# Altium schematic sheet XH-DSP.schdoc
size 309 x 223 mm; Symbol: Sheet-Symbol_A4; Device: Sheet-Symbol_A4; Company: 嘉立创EDA; Version: V1.0; Page Size: A4; @Project Name: XH-DSP; @Page Count: 1; @Update Date: 2024-03-15; @Create Date: 2024-03-03; @Schematic Name: Schematic1; @Page No: 1; @Page Name: P1
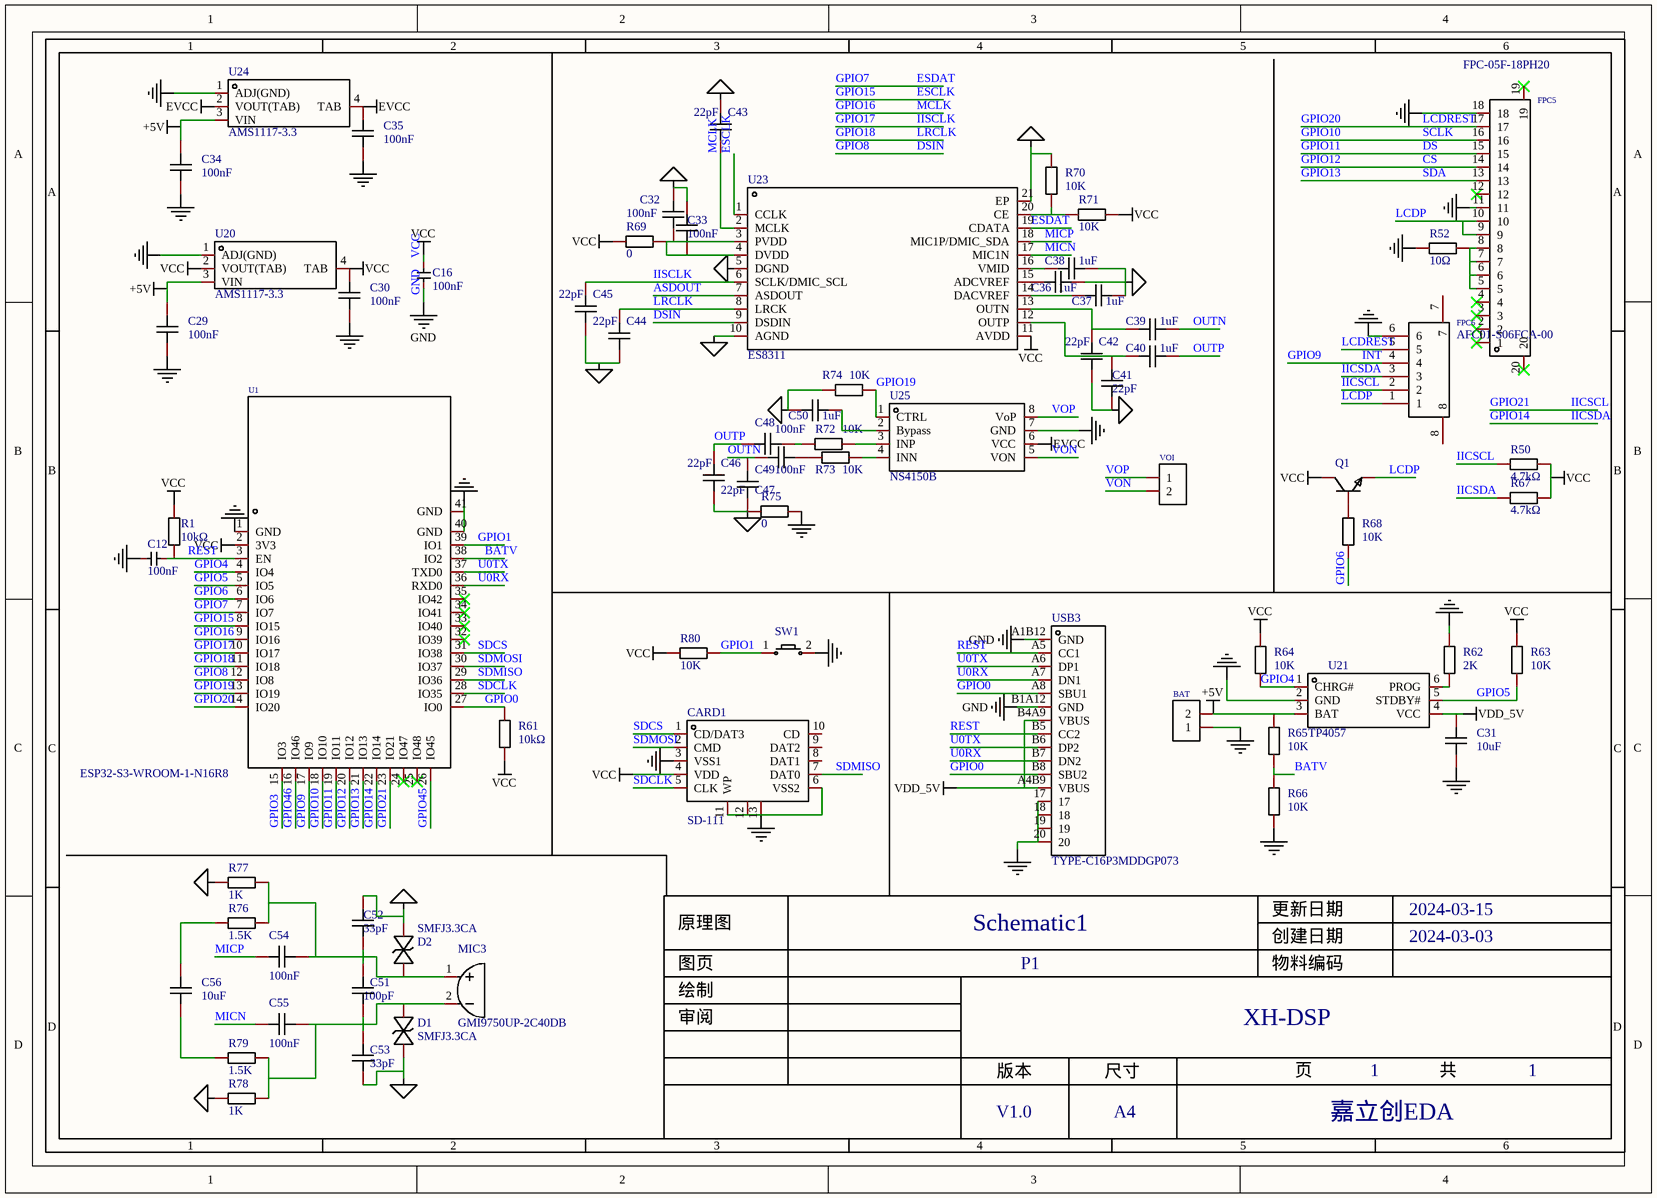
[diagram p0: XH-DSP.schdoc]

## Parts
BAT  HDR-F_2.54_1x2P  [HDR-TH_2P-P2.54-V-F]  (value not drawn)
C12  100nF  [C0402]
C16  100nF  [C0402]
C29  100nF  [C0805]
C30  100nF  [C0805]
C31  10uF  [C0603]
C32  100nF  [C0402]
C33  100nF  [C0402]
C34  100nF  [C0805]
C35  100nF  [C0805]
C36  1uF  [C0402]
C37  1uF  [C0402]
C38  1uF  [C0402]
C39  1uF  [C0402]
C40  1uF  [C0402]
C41  22pF  [C0402]
C42  22pF  [C0402]
C43  22pF  [C0402]
C44  22pF  [C0402]
C45  22pF  [C0402]
C46  22pF  [C0402]
C47  22pF  [C0402]
C48  100nF  [C0402]
C49  100nF  [C0402]
C50  1uF  [C0402]
C51  100pF  [C0402]
C52  33pF  [C0402]
C53  33pF  [C0402]
C54  100nF  [C0402]
C55  100nF  [C0402]
C56  10uF  [C0603]
CARD1  SD-111  [SD-SMD_SD-01A]
D1  SMFJ3.3CA  [SOD-123_L2.7-W1.6-LS3.7-BI]
D2  SMFJ3.3CA  [SOD-123_L2.7-W1.6-LS3.7-BI]
FPC5  FPC-05F-18PH20  [FPC-SMD_18P-P0.50_FPC-05F-18PH20]
FPC6  AFC01-S06FCA-00  [FPC-SMD_P0.50-6P_AFC01-S06FCA-00]
MIC3  GMI9750UP-2C40DB  [MIC-TH_BD9.7-P2.50-D0.8-L-FD]
Q1  S8050_SOT_NPN  [S8050_SOT-23]  (value not drawn)
R1  10kΩ  [R0603]
R50  4.7kΩ  [R0402]
R52  10Ω  [R0402]
R61  10kΩ  [R0603]
R62  2K  [R0402]
R63  10K  [R0603]
R64  10K  [R0603]
R65  10K  [R0603]
R66  10K  [R0603]
R67  4.7kΩ  [R0402]
R68  10K  [R0603]
R69  0  [R0402]
R70  10K  [R0402]
R71  10K  [R0402]
R72  10K  [R0402]
R73  10K  [R0402]
R74  10K  [R0402]
R75  0  [R0402]
R76  1.5K  [R0402]
R77  1K  [R0402]
R78  1K  [R0402]
R79  1.5K  [R0402]
R80  10K  [R0402]
SW1  Key_SMD_3x4x2  [Key_SMD_3x4x2]  (value not drawn)
U1  ESP32-S3-WROOM-1-N16R8  [WIRELM-SMD_ESP32-S3-WROOM-1]
U20  AMS1117-3.3  [SOT-223-4_L6.5-W3.5-P2.30-LS7.0-BR]
U21  TP4057  [SOT-23-6_L2.9-W1.6-P0.95-LS2.8-BR]
U23  ES8311  [WQFN-20_L3.0-W3.0-P0.40-BL-EP1.7]
U24  AMS1117-3.3  [SOT-223-4_L6.5-W3.5-P2.30-LS7.0-BR]
U25  NS4150B  [MSOP-8_L3.0-W3.0-P0.65-LS5.0-BL]
USB3  TYPE-C16P3MDDGP073  [USB-SMD_TYPE-C16PIN-1]
VOI  HDR-F_2.54_1x2P  [HDR-TH_2P-P2.54-V-F]  (value not drawn)

## Nets
+5V: BAT.2 C29.2 C34.2 R65.2 U20.3(VIN) U21.3(BAT) U24.3(VIN)
EVCC: C35.2 U24.2(VOUT(TAB)) U24.4(TAB) U25.6(VCC)
GND: C16.1 USB3.17 USB3.18 USB3.19 USB3.20 USB3.A1B12(GND) USB3.B1A12(GND)
NetBAT_1: BAT.1 C12.2 C29.1 C30.1 C31.1 C32.2 C33.2 C34.1 C35.1 C36.2 C37.2 C38.2 C41.1 C42.1 C43.2 C44.1 C45.1 C46.1 C47.1 C50.1 C52.2 C53.1 CARD1.3(VSS1) CARD1.6(VSS2) CARD1.11(WP) CARD1.12(EP) CARD1.13(EP) D1.1 D2.2 FPC5.11 FPC5.18 FPC6.6 R52.2 R62.2 R66.2 R70.2 R74.1 R75.1 R75.2 R77.2 R78.2 SW1.2 U1.1(GND) U1.40(GND) U1.41(GND) U20.1(ADJ(GND)) U21.2(GND) U23.5(DGND) U23.10(AGND) U23.21(EP) U24.1(ADJ(GND)) U25.7(GND)
VCC: C16.2 C30.2 CARD1.4(VDD) Q1.3 R1.2 R50.2 R61.1 R63.2 R64.2 R67.2 R69.1 R71.1 R80.1 U1.2(3V3) U20.2(VOUT(TAB)) U20.4(TAB) U23.11(AVDD)
VDD_5V: C31.2 U21.4(VCC) USB3.A4B9(VBUS) USB3.B4A9(VBUS)
ASDOUT: U23.7(ASDOUT)
BATV: R65.1 R66.1 U1.38(IO2)
CS: FPC5.14 U1.20(IO12)  [also labelled GPIO12]
DS: FPC5.15 U1.19(IO11)  [also labelled GPIO11]
DSIN: U1.12(IO8) U23.9(DSDIN)  [also labelled GPIO8]
ESCLK: U1.8(IO15) U23.1(CCLK)  [also labelled GPIO15]
ESDAT: U1.7(IO7) U23.19(CDATA)  [also labelled GPIO7]
GPIO0: R61.2 U1.27(IO0) USB3.A8(SBU1) USB3.B8(SBU2)
GPIO1: R80.2 SW1.1 U1.39(IO1)
GPIO3: U1.15(IO3)
GPIO4: R64.1 U1.4(IO4) U21.1(CHRG#)
GPIO5: R63.1 U1.5(IO5) U21.5(STDBY#)
GPIO6: R68.1 U1.6(IO6)
GPIO9: FPC6.4 U1.17(IO9)  [also labelled INT]
GPIO10: FPC5.16 U1.18(IO10)  [also labelled SCLK]
GPIO13: FPC5.13 U1.21(IO13)  [also labelled SDA]
GPIO14: FPC6.3 R67.1 U1.22(IO14)  [also labelled IICSDA]
GPIO16: C43.1 U1.9(IO16) U23.2(MCLK)  [also labelled MCLK]
GPIO17: C45.2 U1.10(IO17) U23.6(SCLK/DMIC_SCL)  [also labelled IISCLK]
GPIO18: C44.2 U1.11(IO18) U23.8(LRCK)  [also labelled LRCLK]
GPIO19: R74.2 U1.13(IO19) U25.1(CTRL)
GPIO20: FPC5.17 FPC6.5 U1.14(IO20)  [also labelled LCDREST]
GPIO21: FPC6.2 R50.1 U1.23(IO21)  [also labelled IICSCL]
GPIO45: U1.26(IO45)
GPIO46: U1.16(IO46)
LCDP: FPC5.9 FPC5.10 FPC6.1 Q1.2
MICN: C55.1 U23.17(MIC1N)
MICP: C54.1 U23.18(MIC1P/DMIC_SDA)
OUTN: C39.2 C47.2 C49.1
OUTP: C40.2 C46.2 C48.1
REST: C12.1 R1.1 U1.3(EN) USB3.A5(CC1) USB3.B5(CC2)
SDCLK: CARD1.5(CLK) U1.28(IO35)
SDCS: CARD1.1(CD/DAT3) U1.31(IO38)
SDMISO: CARD1.7(DAT0) U1.29(IO36)
SDMOSI: CARD1.2(CMD) U1.30(IO37)
U0RX: U1.36(RXD0) USB3.A7(DN1) USB3.B7(DN2)
U0TX: U1.37(TXD0) USB3.A6(DP1) USB3.B6(DP2)
VON: U25.5(VON) VOI.2
VOP: U25.8(VoP) VOI.1
NetC32_1: C32.1 C33.1 R69.2 U23.3(PVDD) U23.4(DVDD)
NetC36_1: C36.1 U23.15(ADCVREF)
NetC37_1: C37.1 U23.14(DACVREF)
NetC38_1: C38.1 U23.16(VMID)
NetC39_1: C39.1 C42.2 U23.13(OUTN)
NetC40_1: C40.1 C41.2 U23.12(OUTP)
NetC48_2: C48.2 R72.1
NetC49_2: C49.2 R73.1
NetC50_2: C50.2 U25.2(Bypass)
NetC51_1: C51.1 C53.2 C55.2 D1.2 MIC3.2 R78.1 R79.1
NetC51_2: C51.2 C52.1 C54.2 D2.1 MIC3.1 R76.1 R77.1
NetC56_1: C56.1 R79.2
NetC56_2: C56.2 R76.2
NetFPC5_5: FPC5.5 FPC5.6 FPC5.7 FPC5.8 R52.1
NetQ1_1: Q1.1 R68.2
NetR62_1: R62.1 U21.6(PROG)
NetR70_1: R70.1 R71.2 U23.20(CE)
NetR72_2: R72.2 U25.3(INP)
NetR73_2: R73.2 U25.4(INN)

Not connected (* = marked no-connect by the designer): CARD1 8(DAT1) 9(DAT2) 10(CD); FPC5 1* 2* 3* 4* 12* 19* 20*; FPC6 7 8; U1 24(IO47)* 25(IO48)* 32(IO39)* 33(IO40)* 34(IO41)* 35(IO42)*

## Notes on the sheet
- 1
- 2
- 3
- 4
- 5
- 6
- A
- B
- C
- 原理图
- Schematic1
- 创建日期
- 更新日期
- 2024-03-15
- 2024-03-03
- 审阅
- 绘制
- 图页
- P1
- 物料编码
- XH-DSP
- D
- 版本
- 尺寸
- 页
- 共
- V1.0
- A4
- 嘉立创EDA

## Library data of the parts
BAT VOI = HDR-F_2.54_1x2P: Manufacturer: BOOMELE(博穆精密); Manufacturer Part: 2.54-1*2P母; Symbol: Header-Female-2.54_1x2; Convert to PCB: yes; Device: HDR-F_2.54_1x2P; Supplier: LCSC; Supplier Part: C49661; JLCPCB Part Class: Extended Part; Add into BOM: yes; Supplier Footprint: 插件
C12 C16 = CL05B104KO5NNNC: 容值:100nF;精度:±10%;额定电压:16V;材质(温度系数):X7R;; Manufacturer: SAMSUNG(三星); Symbol: 电容-0402; Add into BOM: yes; Tolerance: ±10%; Voltage Rated: 16V; Temperature Coefficient: X7R; Origin Footprint: C-0402; Name: 100nF; Device: CL05B104KO5NNNC; LCSC Part Name: 100nF ±10% 16V; Supplier Part: C1525; Manufacturer Part: CL05B104KO5NNNC; Supplier Footprint: 0402; JLCPCB Part Class: Basic Part; Datasheet: https://atta.szlcsc.com/upload/public/pdf/source/20160103/1457707674891.pdf; Supplier: LCSC; Convert to PCB: yes; Value: 100nF; Design Item ID: 电容-0402; Library Name: MyPcbLib
C29 C30 C34 C35 = 0805B104K500NT: Manufacturer: FH(风华); Symbol: CapAcitance; Add into BOM: yes; Tolerance: ±10%; Voltage Rated: 50V; Temperature Coefficient: X7R; Description: 容值:100nF;精度:±10%;额定电压:50V;材质(温度系数):X7R;; Name: 100nF; Device: 0805B104K500NT; LCSC Part Name: 100nF ±10% 50V; Supplier Part: C38141; Manufacturer Part: 0805B104K500NT; Supplier Footprint: 0805; JLCPCB Part Class: Extended Part; Datasheet: https://atta.szlcsc.com/upload/public/pdf/source/20170923/C38141_1506149447419988747.pdf; Supplier: LCSC; Convert to PCB: yes; Value: 100nF
C31 = CAP_0603: Symbol: CapAcitance; Convert to PCB: yes; Name: 10uF; Device: CAP_0603; Add into BOM: yes; Supplier Footprint: 0603; Value: 10uF
C32 C33 C36-C56 = CAP_0402: Symbol: CapAcitance; Convert to PCB: yes; Device: CAP_0402; Add into BOM: yes; Supplier Footprint: 0402
  C32 C33 C48 C49 C54 C55: Name: 100nF; Value: 100nF
  C36-C40 C50: Name: 1uF; Value: 1uF
  C41-C47: Name: 22pF; Value: 22pF
  C51: Name: 100pF; Value: 100pF
  C52 C53: Name: 33pF; Value: 33pF
  C56: Name: 10uF; Value: 10uF
CARD1 = SD-111: Manufacturer: HANBO(汉博); Add into BOM: yes; Card Connection Mode: 自弹式; Card Type: 标准SD卡; Connector Type: 卡座; Maximum Body Height: 2.9mm; Description: 卡连接方式:自弹式;卡类型:标准SD卡;连接器类型:卡座;本体最大高度:2.9mm;触头镀层:镀金;工作温度范围:-45℃~+85℃;; Name: SD-111; Symbol: SD-111; Device: SD-111; Supplier: LCSC; Supplier Part: C410353; Manufacturer Part: SD-111; JLCPCB Part Class: 扩展库; LCSC Part Name: 自弹式 标准SD卡 卡座; Supplier Footprint: SMD; Datasheet: https://atta.szlcsc.com/upload/public/pdf/source/20221111/A999E082C083ECA57C7E4E96336E71F5.pdf; Convert to PCB: yes; Contact Plating: 镀金; Operating Temperature Range: -45℃~+85℃
D1 D2 = SMFJ3.3CA: Manufacturer: BORN(伯恩半导体); Add into BOM: yes; Type: ESD; Description: SOD-123 200W  VRWM=3.3V 双向 功率TVS 电源口等; Name: SMFJ3.3CA; Symbol: SMFJ3.3CA; Device: SMFJ3.3CA; Supplier: LCSC; Supplier Part: C511919; Manufacturer Part: SMFJ3.3CA; JLCPCB Part Class: 扩展库; LCSC Part Name: SMFJ3.3CA; Supplier Footprint: SOD-123; Datasheet: https://atta.szlcsc.com/upload/public/pdf/source/20220819/7A7ECAA22EB2D2C0D7168D96D0DEA0BB.pdf; Convert to PCB: yes
FPC5 = FPC-05F-18PH20: Manufacturer: XUNPU(讯普); Add into BOM: yes; Pitch: 0.5mm; Number of Contacts: 18P; Locking Feature: 翻盖式; FFC, FCB Thickness: 0.3mm; Description: 间距:0.5mm;触点数量:18P;锁定特性:翻盖式;安装类型:卧贴;触点类型:下接;工作温度范围:-25℃~+85℃;; Name: FPC-05F-18PH20; Symbol: FPC-05F-18PH20; Device: FPC-05F-18PH20; Supplier: LCSC; Supplier Part: C2856802; Manufacturer Part: FPC-05F-18PH20; JLCPCB Part Class: 扩展库; LCSC Part Name: 0.5mm P数:18P 翻盖式 下接; Supplier Footprint: SMD,P=0.5mm; Datasheet: https://atta.szlcsc.com/upload/public/pdf/source/20210922/C2856802_2A845D1961F33AEC1ED22CECB292335F.pdf; Convert to PCB: yes; Mounting Type: 卧贴; Contact Type: 下接; Height Above Board: 2mm; Operating Temperature Range: -25℃~+85℃
FPC6 = AFC01-S06FCA-00: Manufacturer: JS(钜硕电子); Add into BOM: yes; Pitch: 0.5mm; Number of Contacts: 6; Locking Feature: 翻盖式; FFC, FCB Thickness: 0.3mm~0.3mm; Description: 间距:0.5mm;触点数量:6;锁定特性:翻盖式;安装类型:卧贴;触点类型:下接;; Name: AFC01-S06FCA-00; Symbol: AFC01-S06FCA-00; Device: AFC01-S06FCA-00; Supplier: LCSC; Supplier Part: C262655; Manufacturer Part: AFC01-S06FCA-00; JLCPCB Part Class: 扩展库; LCSC Part Name: FPC 0.5MM 6P 翻盖式 H2.0mm 下接; Supplier Footprint: P=0.5mm; Convert to PCB: yes; Mounting Type: 卧贴; Contact Type: 下接; Height Above Board: 2mm
MIC3 = GMI9750UP-2C40DB: Manufacturer: INGHAi(赢海); Add into BOM: yes; Name: GMI9750UP-2C40DB; Symbol: GMI9750UP-2C40DB; Device: GMI9750UP-2C40DB; LCSC Part Name: GMI9750UP-2C40DB; Supplier Part: C530221; Manufacturer Part: GMI9750UP-2C40DB; Supplier Footprint: -; JLCPCB Part Class: 扩展库; Datasheet: https://atta.szlcsc.com/upload/public/pdf/source/20231017/7730F5E17633AEF7C001E490CA532738.pdf; Supplier: LCSC; Convert to PCB: yes
Q1 = S8050_SOT_NPN: Symbol: NPN; Convert to PCB: yes; Device: S8050_SOT_NPN; Add into BOM: yes; Supplier Footprint: SOT-23
R1 R61 = 0603WAF1002T5E: Manufacturer: UNI-ROYAL(厚声); Add into BOM: yes; Tolerance: ±1%; Power(Watts): 100mW; Temperature Coefficient: ±100ppm/℃; Overload Voltage (Max): 75V; Description: 电阻类型:厚膜电阻;阻值:10kΩ;精度:±1%;功率:100mW;; Name: 10kΩ; Symbol: 0603WAF1002T5E; Device: 0603WAF1002T5E; LCSC Part Name: 厚膜电阻 10kΩ ±1% 100mW; Supplier Part: C25804; Manufacturer Part: 0603WAF1002T5E; Supplier Footprint: 0603; JLCPCB Part Class: Basic Part; Datasheet: https://atta.szlcsc.com/upload/public/pdf/source/20200306/C422600_1E6D84923E4A46A82E41ADD87F860B5C.pdf; Supplier: LCSC; Convert to PCB: yes; Type: 厚膜电阻; Value: 10kΩ; Operating Temperature Range: -55℃~+155℃
R50 R67 = 0402WGF4701TCE: Manufacturer: UNI-ROYAL(厚声); Add into BOM: yes; Tolerance: ±1%; Power(Watts): 62.5mW; Temperature Coefficient: ±100ppm/℃; Overload Voltage (Max): 50V; Description: 电阻类型:厚膜电阻;阻值:4.7kΩ;精度:±1%;功率:62.5mW;; Name: 4.7kΩ; Symbol: 0402WGF4701TCE; Device: 0402WGF4701TCE; LCSC Part Name: 4.7kΩ ±1% 62.5mW; Supplier Part: C25900; Manufacturer Part: 0402WGF4701TCE; Supplier Footprint: 0402; JLCPCB Part Class: 基础库; Datasheet: https://atta.szlcsc.com/upload/public/pdf/source/20200306/C422600_1E6D84923E4A46A82E41ADD87F860B5C.pdf; Supplier: LCSC; Convert to PCB: yes; Type: 厚膜电阻; Value: 4.7kΩ; Operating Temperature Range: -55℃~+155℃
R52 = 0402WGF100JTCE: Manufacturer: UNI-ROYAL(厚声); Symbol: 0402WGF1001TCE; Add into BOM: yes; Tolerance: ±1%; Power(Watts): 62.5mW; Temperature Coefficient: ±200ppm/℃; Overload Voltage (Max): 50V; Description: 电阻类型:厚膜电阻;阻值:10Ω;精度:±1%;功率:62.5mW;; Name: 10Ω; Device: 0402WGF100JTCE; LCSC Part Name: 10Ω ±1% 62.5mW; Supplier Part: C25077; Manufacturer Part: 0402WGF100JTCE; Supplier Footprint: 0402; JLCPCB Part Class: Basic Part; Datasheet: https://atta.szlcsc.com/upload/public/pdf/source/20200306/C422600_1E6D84923E4A46A82E41ADD87F860B5C.pdf; Supplier: LCSC; Convert to PCB: yes; Type: 厚膜电阻; Value: 10Ω; Operating Temperature Range: -55℃~+155℃
R62 R69-R80 = Res_0402: Symbol: 电阻; Convert to PCB: yes; Device: Res_0402; Add into BOM: yes; Supplier Footprint: 0402
  R62: Name: 2K; Value: 2K
  R69 R75: Name: 0; Value: 0
  R70-R74 R80: Name: 10K; Value: 10K
  R76 R79: Name: 1.5K; Value: 1.5K
  R77 R78: Name: 1K; Value: 1K
R63-R66 R68 = Res_0603: Symbol: 电阻; Convert to PCB: yes; Name: 10K; Device: Res_0603; Add into BOM: yes; Supplier Footprint: 0603; Value: 10K
SW1 = Key_SMD_3x4x2: Symbol: 轻触按键x2; Convert to PCB: yes; Device: Key_SMD_3x4x2; Add into BOM: yes; Supplier Footprint: SMD
U1 = ESP32-S3-WROOM-1-N16R8: Manufacturer: ESPRESSIF(乐鑫); Symbol: ESP32-S3-WROOM-1(N16R8); Add into BOM: yes; Name: ESP32-S3-WROOM-1-N16R8; Device: ESP32-S3-WROOM-1-N16R8; Supplier: LCSC; Supplier Part: C2913202; Manufacturer Part: ESP32-S3-WROOM-1-N16R8; JLCPCB Part Class: 扩展库; LCSC Part Name: 通用型Wi-Fi+低功耗蓝牙MCU模组; Supplier Footprint: SMD,18x25.5mm; Datasheet: https://atta.szlcsc.com/upload/public/pdf/source/20220705/4E799F39581577F766659887F738A439.pdf; Convert to PCB: yes
U20 U24 = AMS1117-3.3_C347222: Manufacturer: UMW(广东友台半导体); Add into BOM: yes; Output Type: 固定; Output Polarity: 正; Number of Outputs: 1; Maximum Input Voltage: 18V; Output Voltage: 3.3V; Dropout Voltage: 1.3V@(1A); Output Current: 1A; Power Supply Rejection Ratio (PSRR): 60dB@(120Hz); Description: 输出类型:固定;输出极性:正;最大输入电压:18V;输出电压:3.3V;输出电流:1A;电源纹波抑制比(PSRR):60dB@(120Hz);; Name: AMS1117-3.3; Symbol: AMS1117-3.3_C347222; Device: AMS1117-3.3_C347222; LCSC Part Name: AMS1117-3.3; Supplier Part: C347222; Manufacturer Part: AMS1117-3.3; Supplier Footprint: SOT-223; JLCPCB Part Class: Extended Part; Datasheet: https://atta.szlcsc.com/upload/public/pdf/source/20211011/50CC665C22E3A66C08379A4A74BDA25C.pdf; Supplier: LCSC; Convert to PCB: yes
U21 = TP4057: Manufacturer: UMW(友台半导体); Symbol: TP4057_C725791; Add into BOM: yes; Supply Voltage: 6.5V; Maximum Charge Current: 500mA; Type of Battery: 锂离子/聚合物; Number of Cells: 1; Description: 电源电压:6.5V;最大充电电流:500mA;电池类型:锂离子/聚合物;电池节数:1;; Name: TP4057; Device: TP4057; LCSC Part Name: TP4057; Supplier Part: C725791; Manufacturer Part: TP4057; Supplier Footprint: SOT-23-6; JLCPCB Part Class: 扩展库; Datasheet: https://atta.szlcsc.com/upload/public/pdf/source/20231109/7FB39B0490CD1514A6792371FCA0BB30.pdf; Supplier: LCSC; Convert to PCB: yes; Operating Temperature: -40℃~+85℃
U23 = ES8311: Manufacturer: Everest-semi(顺芯); Add into BOM: yes; Name: ES8311; Symbol: ES8311; Device: ES8311; LCSC Part Name: ES8311; Supplier Part: C962342; Manufacturer Part: ES8311; Supplier Footprint: WQFN-20-EP(3x3); JLCPCB Part Class: 扩展库; Datasheet: https://atta.szlcsc.com/upload/public/pdf/source/20210630/C962342_E665EAE7274179BC7C5A390EC8AC685C.pdf; Supplier: LCSC; Convert to PCB: yes
U25 = NS4150B_C189961: Manufacturer: Nsiway(纳芯威); Symbol: NS4150; Add into BOM: yes; Type of Power Amplifier: D类功放; Output Power: 3Wx1@4Ω; Supply Voltage: 3V~5.25V; Description: 功放类型:D类功放;输出功率:3Wx1@4Ω;; Name: NS4150B; Device: NS4150B_C189961; LCSC Part Name: NS4150B; Supplier Part: C189961; Manufacturer Part: NS4150B; Supplier Footprint: MSOP-8; JLCPCB Part Class: 扩展库; Datasheet: https://atta.szlcsc.com/upload/public/pdf/source/20220916/DAE631F3909B9CBB38BDE76E3E6D5896.pdf; Supplier: LCSC; Convert to PCB: yes
USB3 = TYPE-C16P3MDDGP073: Manufacturer: SHOU HAN(首韩); Add into BOM: yes; Connector Type: Type-C; Gender: 母座; Number of Contacts: 16; Number of Ports: 1; Current Rating - Power (Max): 5A; Description: 连接器类型:Type-C;标准:-;公母:母座;触点数量:16;端口数量:1;安装方式:卧贴;额定电流 - 电源:5A;触头材质:-;触头镀层:-;工作温度范围:-25℃~+85℃;焊接温度(最大值):-;; Name: TYPE-C16P3MDDGP073; Symbol: TYPE-C16P3MDDGP073; Device: TYPE-C16P3MDDGP073; LCSC Part Name: Type-C 母座 卧贴; Supplier Part: C2965608; Manufacturer Part: TYPE-C16P3MDDGP073; Supplier Footprint: SMD; JLCPCB Part Class: Extended Part; Datasheet: https://atta.szlcsc.com/upload/public/pdf/source/20220407/B6CD8216925DA366D8140ABDDF4F46D3.pdf; Supplier: LCSC; Convert to PCB: yes; Standard: -; Mounting Style: 卧贴; Contact Material: -; Contact Plating: -; Operating Temperature Range: -25℃~+85℃; Welding Temperature (Max): -